# EasyEDA Pro project 小张FOC-STM32G431CBU6.epro, schematic Schematic2
Board Name: MT6816; Create Date: 2024-09-17; Page Name: P1; Project Name: 小张FOC-STM32G431CBU6; Schematic Name: Schematic2; Update Date: 2024-10-14; Company: 嘉立创EDA; Page Size: A4; Version: V1.0
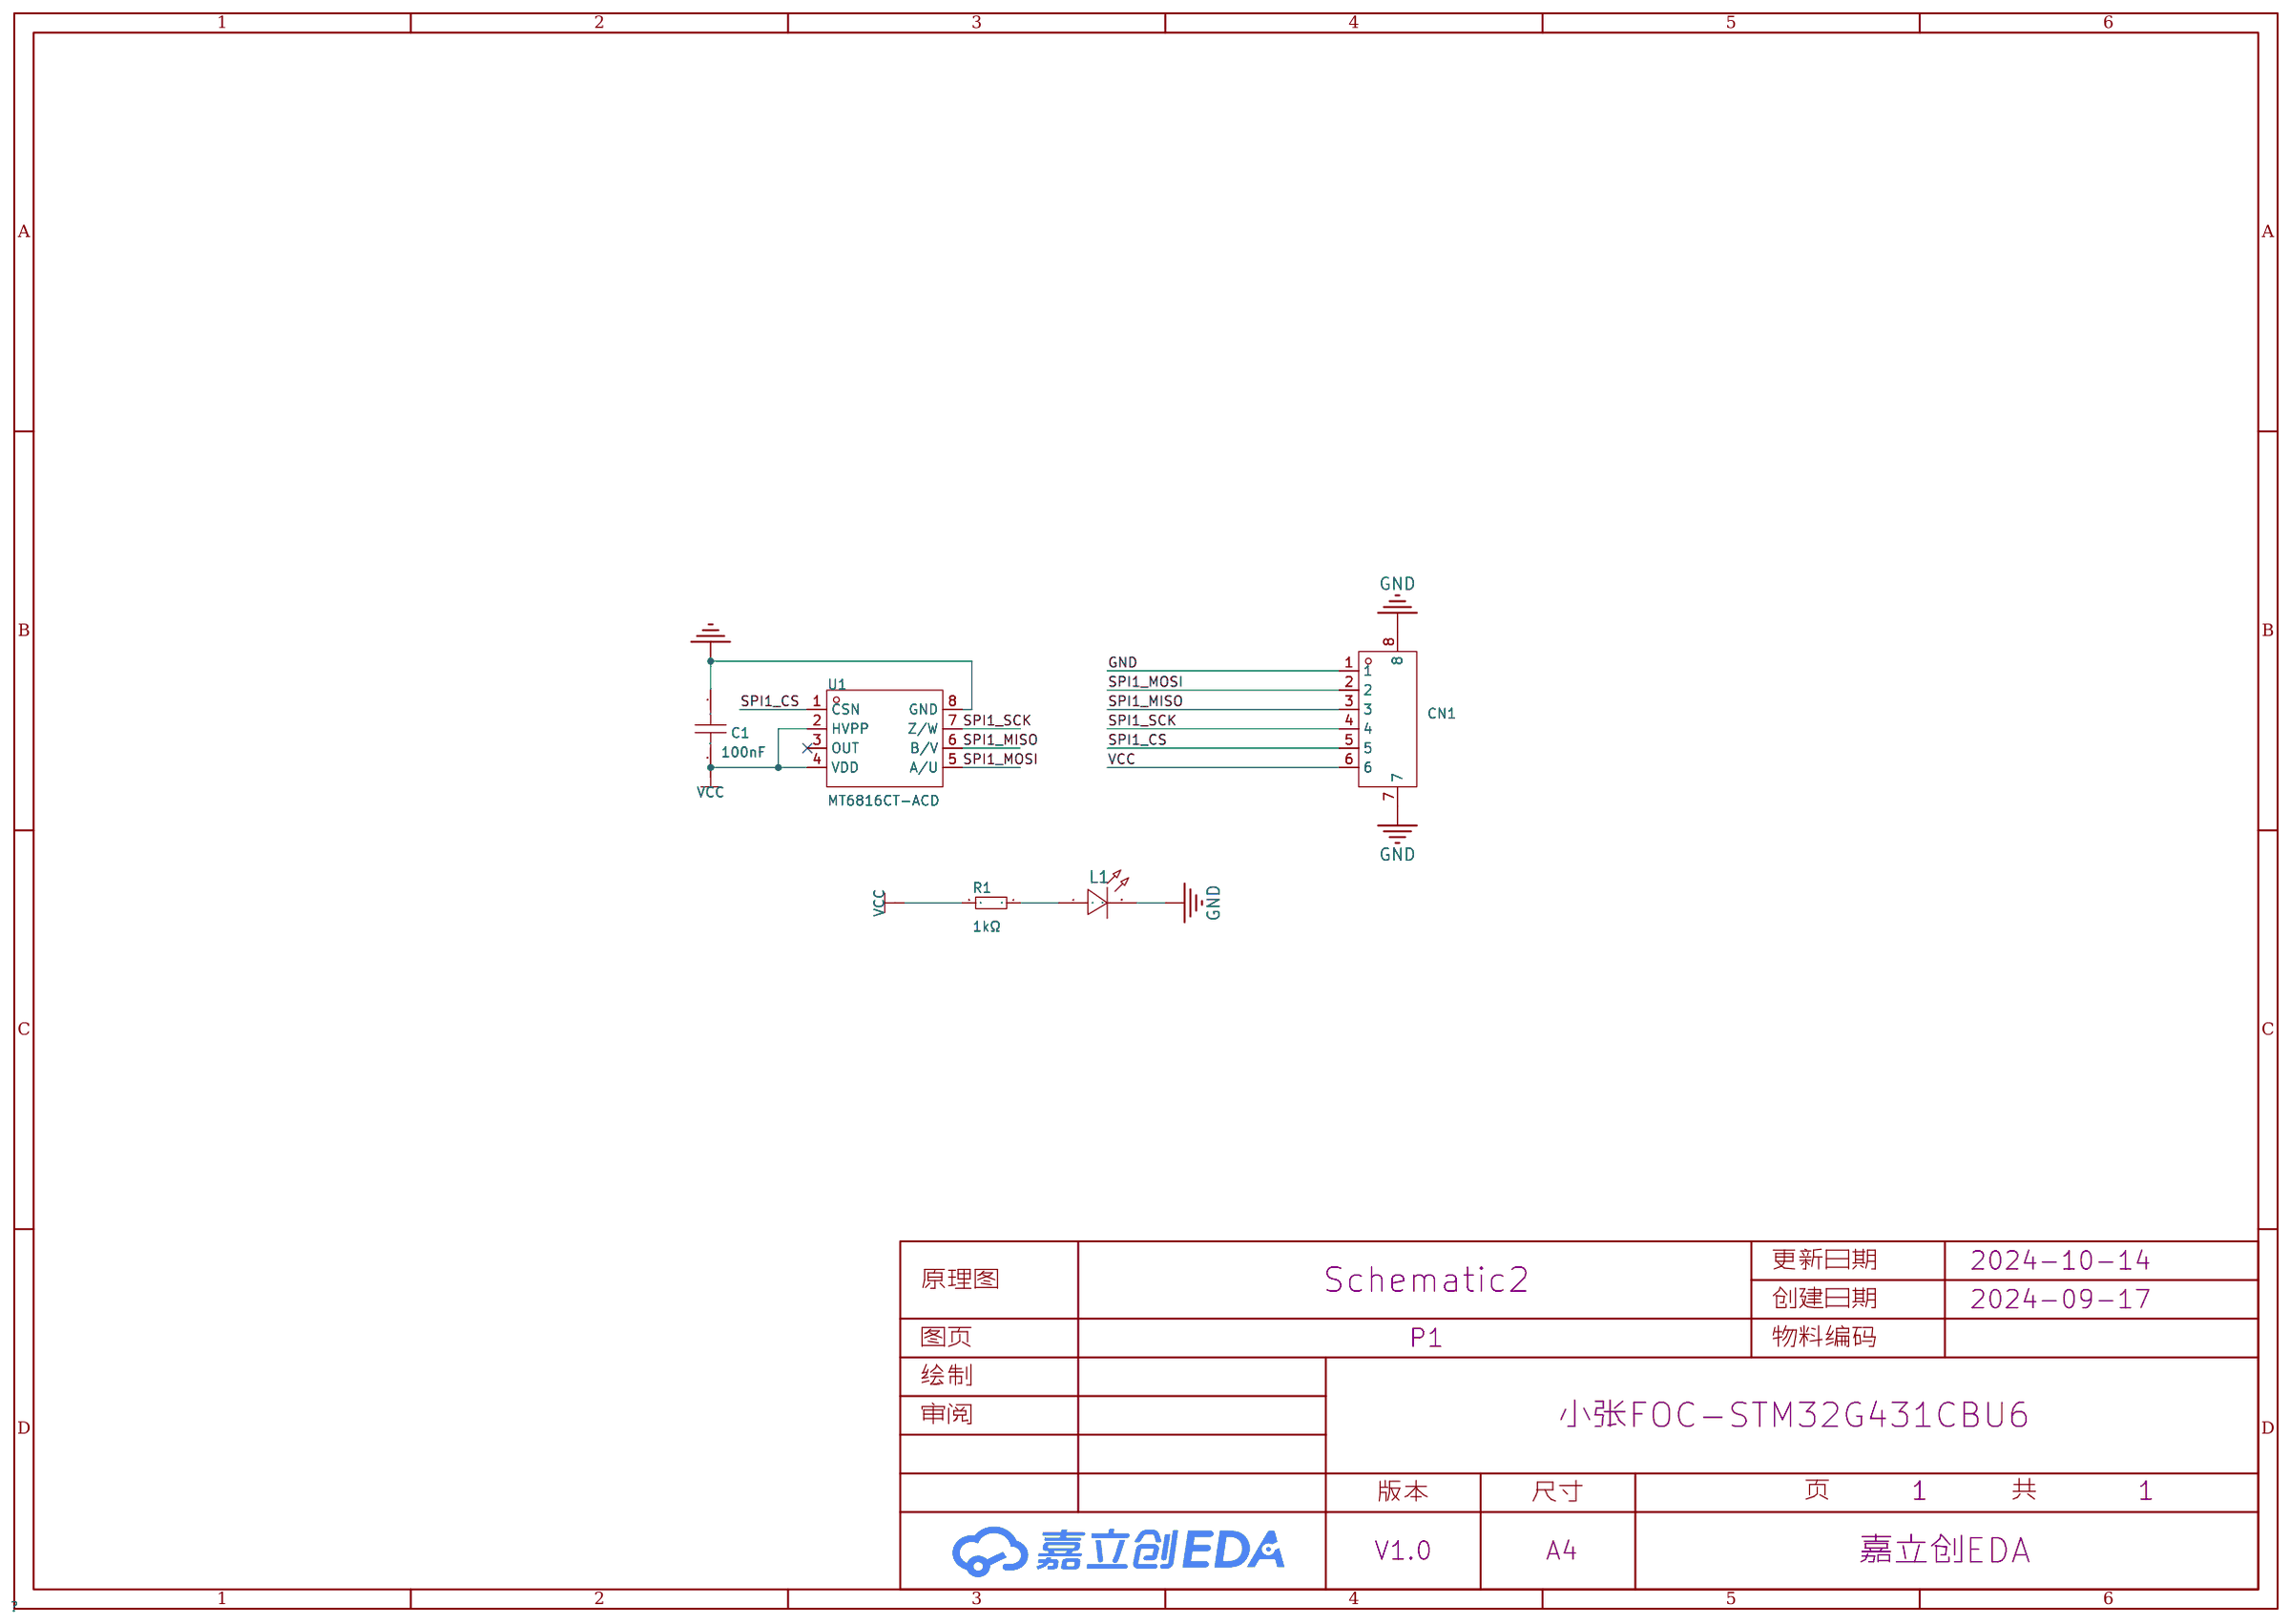
[diagram p5: schematic sheet]

## Parts
C1  100nF  [C0603_SMALL]
CN1  WAFER-GH1.25-6PWB  [CONN-SMD_6P-P1.25_XUNPU_WAFER-GH1.25-6PWB]
L1  NCD0603R1  [LED0603_S]
R1  1kΩ  [R0603_SMALL]
U1  MT6816CT-ACD  [SOP-8_L5.0-W4.0-P1.27-LS6.0-BL]

## Library data of the parts
C1 = 0603B104K500NT: 容值:100nF;精度:±10%;额定电压:50V;材质(温度系数):X7R;; LCSC Part Name: 100nF ±10% 50V; Supplier Part: C30926; Manufacturer: FH(风华); Supplier Footprint: 0603; JLCPCB Part Class: Extended Part; Datasheet: https://atta.szlcsc.com/upload/public/pdf/source/20200305/C486355_26A10D38EF8C2A5C37091D0039909270.pdf; Supplier: LCSC; Tolerance: ±10%; Voltage Rated: 50V; Temperature Coefficient: X7R
CN1 = WAFER-GH1.25-6PWB: 参考系列:GH;间距:1.25mm;插针结构:1x6P;排数:1;每排PIN数:6;公母:公型插针;安装方式:卧贴;额定电流:1A;工作温度范围:-25~+85;; LCSC Part Name: GH1.25mm6P卧贴带扣带扣; Supplier Part: C3029381; Manufacturer: XUNPU(讯普); Supplier Footprint: SMD,P=1.25mm; JLCPCB Part Class: ExtendedPart; Datasheet: https://atta.szlcsc.com/upload/public/pdf/source/20220527/CB8773BFB0913C3B8ABD62CB38BA101A.pdf; Supplier: LCSC; Reference Series: GH; Pitch: 1.25mm; Pins Structure: 1x6P; Number of Rows: 1; Number of PINs Per Row: 6; Gender: 公型插针; Mounting Style: 卧贴; Current Rating (Max): 1A; Operating Temperature Range: -25~+85; Check: true
L1 = NCD0603R1_C84263: 发光颜色:红色;功率:65mW;透镜颜色:无色透明;主波长:615nm~630nm;发光强度:80mcd~220mcd;发光角度:130°;工作温度:-30℃~+85℃;; LCSC Part Name: 红灯 0603红灯   正贴; Supplier Part: C84263; Manufacturer: 国星光电; Supplier Footprint: 0603; JLCPCB Part Class: Extended Part; Datasheet: https://atta.szlcsc.com/upload/public/pdf/source/20200820/C84263_DABC6A75E58F576973B407FDBA283D60.pdf; Supplier: LCSC; Emitted Color: 红色; Forward Voltage (VF): 1.6V~2.6V; Forward Current: 20mA; Power Dissipation: 65mW; Lens Color: 无色透明; Dominant Wavelength: 615nm~630nm; Luminous Intensity: 80mcd~220mcd; Viewing Angle: 130°; Operating Temperature: -30℃~+85℃; Check: true
R1 = RC0603FR-071KL: 电阻类型:厚膜电阻;阻值:1kΩ;精度:±1%;功率:100mW;; LCSC Part Name: 1kΩ ±1% 100mW; Supplier Part: C22548; Manufacturer: YAGEO(国巨); Supplier Footprint: 0603; JLCPCB Part Class: Extended Part; Datasheet: https://atta.szlcsc.com/upload/public/pdf/source/20180312/7BD3618A8B6324EA6280B0497A051AB7.pdf; Supplier: LCSC; Type: 厚膜电阻; Tolerance: ±1%; Power(Watts): 100mW; Temperature Coefficient: ±100ppm/℃; Overload Voltage (Max): 75V; Operating Temperature Range: -55℃~+155℃; Pin Type: IN; Check: true
U1 = MT6816CT-ACD: AB=1024线，Z=4LSB，PWM=1KHz; LCSC Part Name: 零延迟磁角位置传感器IC; Supplier Part: C879560; Manufacturer: MagnTek(麦歌恩); Supplier Footprint: SOP-8; JLCPCB Part Class: 扩展库; Datasheet: https://atta.szlcsc.com/upload/public/pdf/source/20201027/C879560_21F27A21E71569DDEA564795613A647F.pdf; Supplier: LCSC

## Nets
GND: C1.1 CN1.1 CN1.7 CN1.8 L1.2 U1.8(GND)
VCC: C1.2 CN1.6 R1.2 U1.2(HVPP) U1.4(VDD)
SPI1_CS: CN1.5 U1.1(CSN)
SPI1_MISO: CN1.3 U1.6(B/V)
SPI1_MOSI: CN1.2 U1.5(A/U)
SPI1_SCK: CN1.4 U1.7(Z/W)
$1N428: L1.1 R1.1

Not connected (* = marked no-connect by the designer): U1 3(OUT)*
